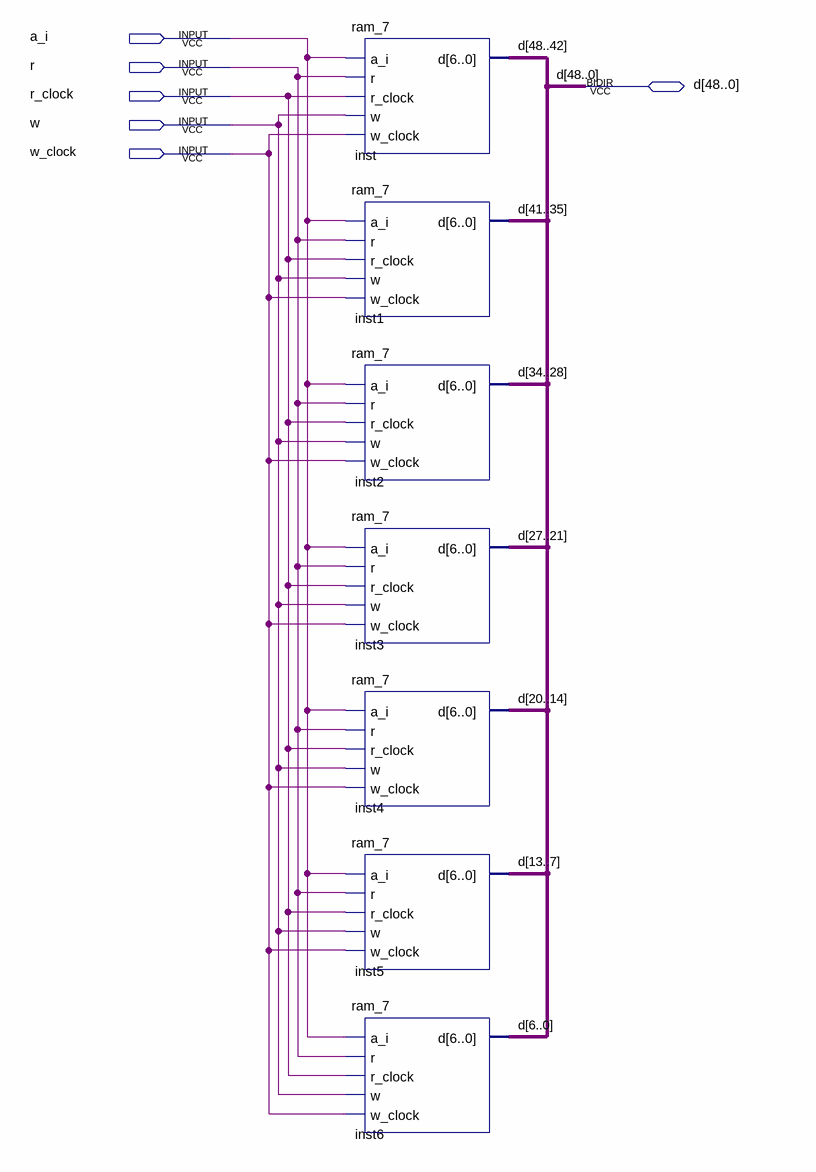
[diagram p0: schematic sheet]
// Quartus schematic ram_48.bdf as structural Verilog: 7 symbols, 6 pins
module ram_48 (
  input  a_i,
  input  r,
  input  r_clock,
  input  w,
  input  w_clock,
  inout  [48:0] d
);

  ram_7 inst (.a_i(a_i), .r(r), .r_clock(r_clock), .w(w), .w_clock(w_clock), .d(d[48:42]));
  ram_7 inst1 (.a_i(a_i), .r(r), .r_clock(r_clock), .w(w), .w_clock(w_clock), .d(d[41:35]));
  ram_7 inst2 (.a_i(a_i), .r(r), .r_clock(r_clock), .w(w), .w_clock(w_clock), .d(d[34:28]));
  ram_7 inst3 (.a_i(a_i), .r(r), .r_clock(r_clock), .w(w), .w_clock(w_clock), .d(d[27:21]));
  ram_7 inst4 (.a_i(a_i), .r(r), .r_clock(r_clock), .w(w), .w_clock(w_clock), .d(d[20:14]));
  ram_7 inst5 (.a_i(a_i), .r(r), .r_clock(r_clock), .w(w), .w_clock(w_clock), .d(d[13:7]));
  ram_7 inst6 (.a_i(a_i), .r(r), .r_clock(r_clock), .w(w), .w_clock(w_clock), .d(d[6:0]));
endmodule
